# EAGLE schematic MintyBoost3_v2 (EAGLE 7.0.0)
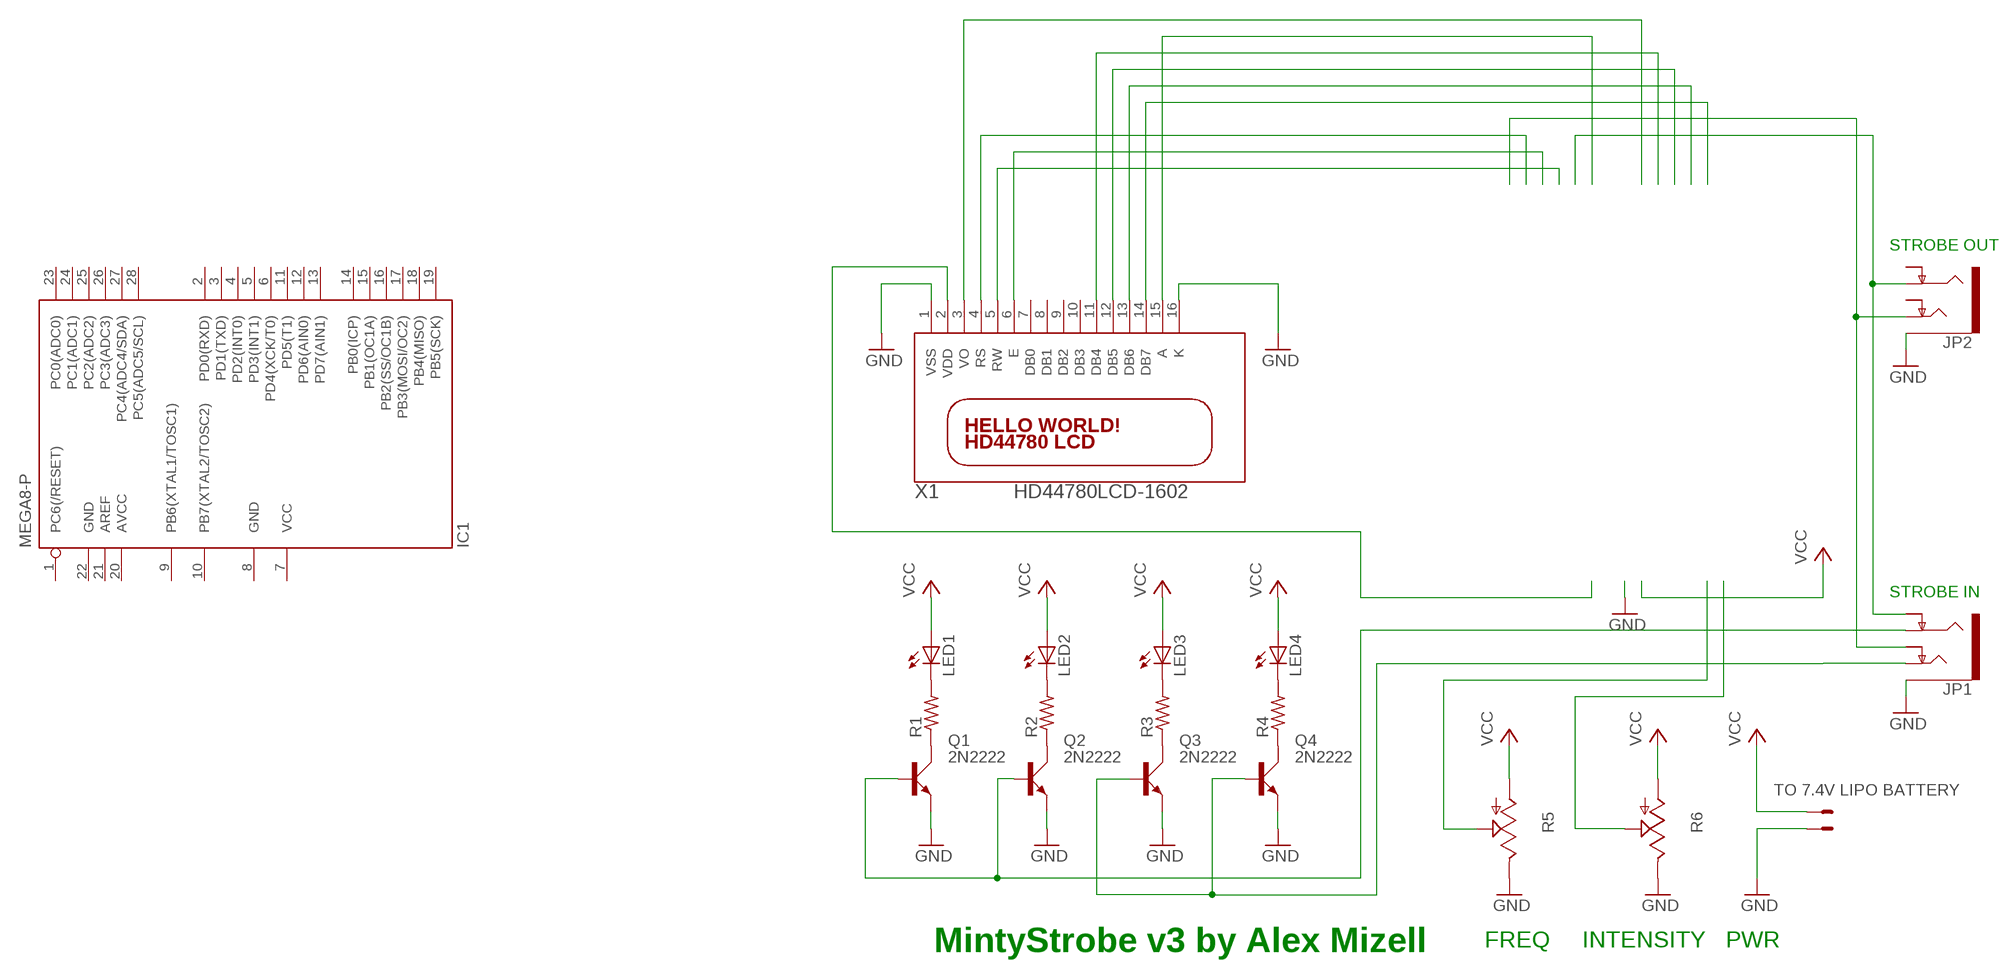
[diagram p0: schematic, sheet 1]

## Parts
+5V  22-23-2021  [22-23-2021]
IC1  MEGA8-P  [DIL28-3]
JP1  AUDIO-JACK5-.25-VERT-TRS  [AUDIO-JACK-.25-INCH-VERT-PTH]
JP2  AUDIO-JACK5-.25-VERT-TRS  [AUDIO-JACK-.25-INCH-VERT-PTH]
LED1  LEDLZR181  [LZR181]
LED2  LEDLZR181  [LZR181]
LED3  LEDLZR181  [LZR181]
LED4  LEDLZR181  [LZR181]
Q1  2N2222  [TO18A]
Q2  2N2222  [TO18A]
Q3  2N2222  [TO18A]
Q4  2N2222  [TO18A]
R1  R-US_0207/10  [0207/10]
R2  R-US_0207/10  [0207/10]
R3  R-US_0207/10  [0207/10]
R4  R-US_0207/10  [0207/10]
R5  TRIM_US-S64W  [S64W]
R6  TRIM_US-S64W  [S64W]
X1  HD44780LCD-1602  [LCD1602]

## Nets
GND: +5V.2 JP1.SLEEVE(EARTH) JP2.SLEEVE(EARTH) Q1.E Q2.E Q3.E Q4.E R5.E R6.E X1.1(VSS) X1.16(K)
N$1: Q1.C R1.1
N$2: Q2.C R2.1
N$3: Q3.C R3.1
N$4: Q4.C R4.1
N$5: LED1.K(C) R1.2
N$6: LED2.K(C) R2.2
N$7: LED3.K(C) R3.2
N$8: LED4.K(C) R4.2
N$9: JP1.RING Q1.B Q2.B
N$10: JP1.TIP-NORM JP2.TIP
N$11: X1.5(RW)
N$12: X1.6(E)
N$13: X1.4(RS)
N$14: X1.14(DB7)
N$15: X1.13(DB6)
N$16: R6.S
N$17: X1.12(DB5)
N$18: X1.11(DB4)
N$19: JP1.RING-NORM JP2.RING
N$20: R5.S
N$22: JP1.TIP Q3.B Q4.B
N$23: X1.15(A)
N$24: X1.3(VO)
VCC: +5V.1 LED1.A LED2.A LED3.A LED4.A R5.A R6.A
VDD: X1.2(VDD)
Unconnected: IC1.1(PC6(/RESET)) IC1.2(PD0(RXD)) IC1.3(PD1(TXD)) IC1.4(PD2(INT0)) IC1.5(PD3(INT1)) IC1.6(PD4(XCK/T0)) IC1.9(PB6(XTAL1/TOSC1)) IC1.10(PB7(XTAL2/TOSC2)) IC1.11(PD5(T1)) IC1.12(PD6(AIN0)) IC1.13(PD7(AIN1)) IC1.14(PB0(ICP)) IC1.15(PB1(OC1A)) IC1.16(PB2(SS/OC1B)) IC1.17(PB3(MOSI/OC2)) IC1.18(PB4(MISO)) IC1.19(PB5(SCK)) IC1.21(AREF) IC1.23(PC0(ADC0)) IC1.24(PC1(ADC1)) IC1.25(PC2(ADC2)) IC1.26(PC3(ADC3)) IC1.27(PC4(ADC4/SDA)) IC1.28(PC5(ADC5/SCL)) JP2.RING-NORM JP2.TIP-NORM X1.7(DB0) X1.8(DB1) X1.9(DB2) X1.10(DB3)

## Notes on the sheet
- STROBE OUT
- STROBE IN
- MintyStrobe v3 by Alex Mizell | INTENSITY | PWR
- FREQ

## Power pins joined to a net without a drawn wire
AVCC: IC1.20(AVCC)
GND: IC1.8(GND) IC1.22(GND)
VCC: IC1.7(VCC)

## Library data of the parts
+5V = con-molex:22-23-2021: .100" (2.54mm) Center Header - 2 Pin; MF: MOLEX; MPN: TO 7.4V LIPO BATTERY; OC_FARNELL: 1462926; OC_NEWARK: 25C3832
IC1 = atmel:MEGA8-P: MICROCONTROLLER 8 Kbytes FLASH, 1 kbytes SRAM, 512 bytes EEPROM, USART, 4-channel 10 bit ADC, 2-channel 8 bit ADC Pin compatible with Atmega48, ATMega88, ATMega168 Source: avr.lbr; OC_FARNELL: unknown; OC_NEWARK: unknown
JP1 JP2 = SparkFun-Connectors:AUDIO-JACK5-.25-VERT-TRS: 1/4" TRS jack, vertical Production SKU: COM-11152 Footprint unproven - datasheet and part seem to be slightly different; PROD_ID: COM-11152
LED1-LED4 = led:LED: LED OSRAM: - CHIPLED LG R971, LG N971, LY N971, LG Q971, LY Q971, LO R971, LY R971 LH N974, LH R974 LS Q976, LO Q976, LY Q976 LO Q996 - Hyper CHIPLED LW Q18S LB Q993, LB Q99A, LB R99A - SideLED LS A670, LO A670, LY A670, LG A670, LP A670 LB A673, LV A673, LT A673, LW A673 LH A674 LY A675 LS A676, LA A676, LO A676, LY A676, LW A676 LS A679, LY A679, LG A679 - Hyper Micro SIDELED® LS Y876, LA Y876, LO Y876, LY Y876 LT Y87S - SmartLED LW L88C, LW L88S LB L89C, LB L89S, LG L890 LS L89K, LO L89K, LY L89K LS L896, LA L896, LO L896, LY L896 - TOPLED LS T670, LO T670, LY T670, LG T670, LP T670 LSG T670, LSP T670, LSY T670, LOP T670, LYG T670 LG T671, LOG T671, LSG T671 LB T673, LV T673, LT T673, LW T673 LH T674 LS T676, LA T676, LO T676, LY T676, LB T676, LH T676, LSB T676, LW T676 LB T67C, LV T67C, LT T67C, LS T67K, LO T67K, LY T67K, LW E67C LS E67B, LA E67B, LO E67B, LY E67B, LB E67C, LV E67C, LT E67C LW T67C LS T679, LY T679, LG T679 LS T770, LO T770, LY T770, LG T770, LP T770 LB T773, LV T773, LT T773, LW T773 LH T774 LS E675, LA E675, LY E675, LS T675 LS T776, LA T776, LO T776, LY T776, LB T776 LHGB T686 LT T68C, LB T68C - Hyper Mini TOPLED® LB M676 - Mini TOPLED Santana® LG M470 LS M47K, LO M47K, LY M47K Source: http://www.osram.convergy.de LUXEON: - LUMILED® LXK2-PW12-R00, LXK2-PW12-S00, LXK2-PW14-U00, LXK2-PW14-V00 LXK2-PM12-R00, LXK2-PM12-S00, LXK2-PM14-U00 LXK2-PE12-Q00, LXK2-PE12-R00, LXK2-PE12-S00, LXK2-PE14-T00, LXK2-PE14-U00 LXK2-PB12-K00, LXK2-PB12-L00, LXK2-PB12-M00, LXK2-PB14-N00, LXK2-PB14-P00, LXK2-PB14-Q00 LXK2-PR12-L00, LXK2-PR12-M00, LXK2-PR14-Q00, LXK2-PR14-R00 LXK2-PD12-Q00, LXK2-PD12-R00, LXK2-PD12-S00 LXK2-PH12-R00, LXK2-PH12-S00 LXK2-PL12-P00, LXK2-PL12-Q00, LXK2-PL12-R00 Source: www.luxeon.com KINGBRIGHT: KA-3528ASYC Source: www.kingbright.com
Q1-Q4 = transistor-small-signal:2N2222: NPN TRANSISTOR
R1-R4 = resistor:R-US_: RESISTOR, American symbol
R5 R6 = pot:TRIM_US-: POTENTIOMETER
X1 = adafruit:HD44780LCD: HD44780 LCD Standard character type LCDs, available in sizes from 8x1 to 40x4!